# EAGLE design charger v2 (EAGLE 5.07)
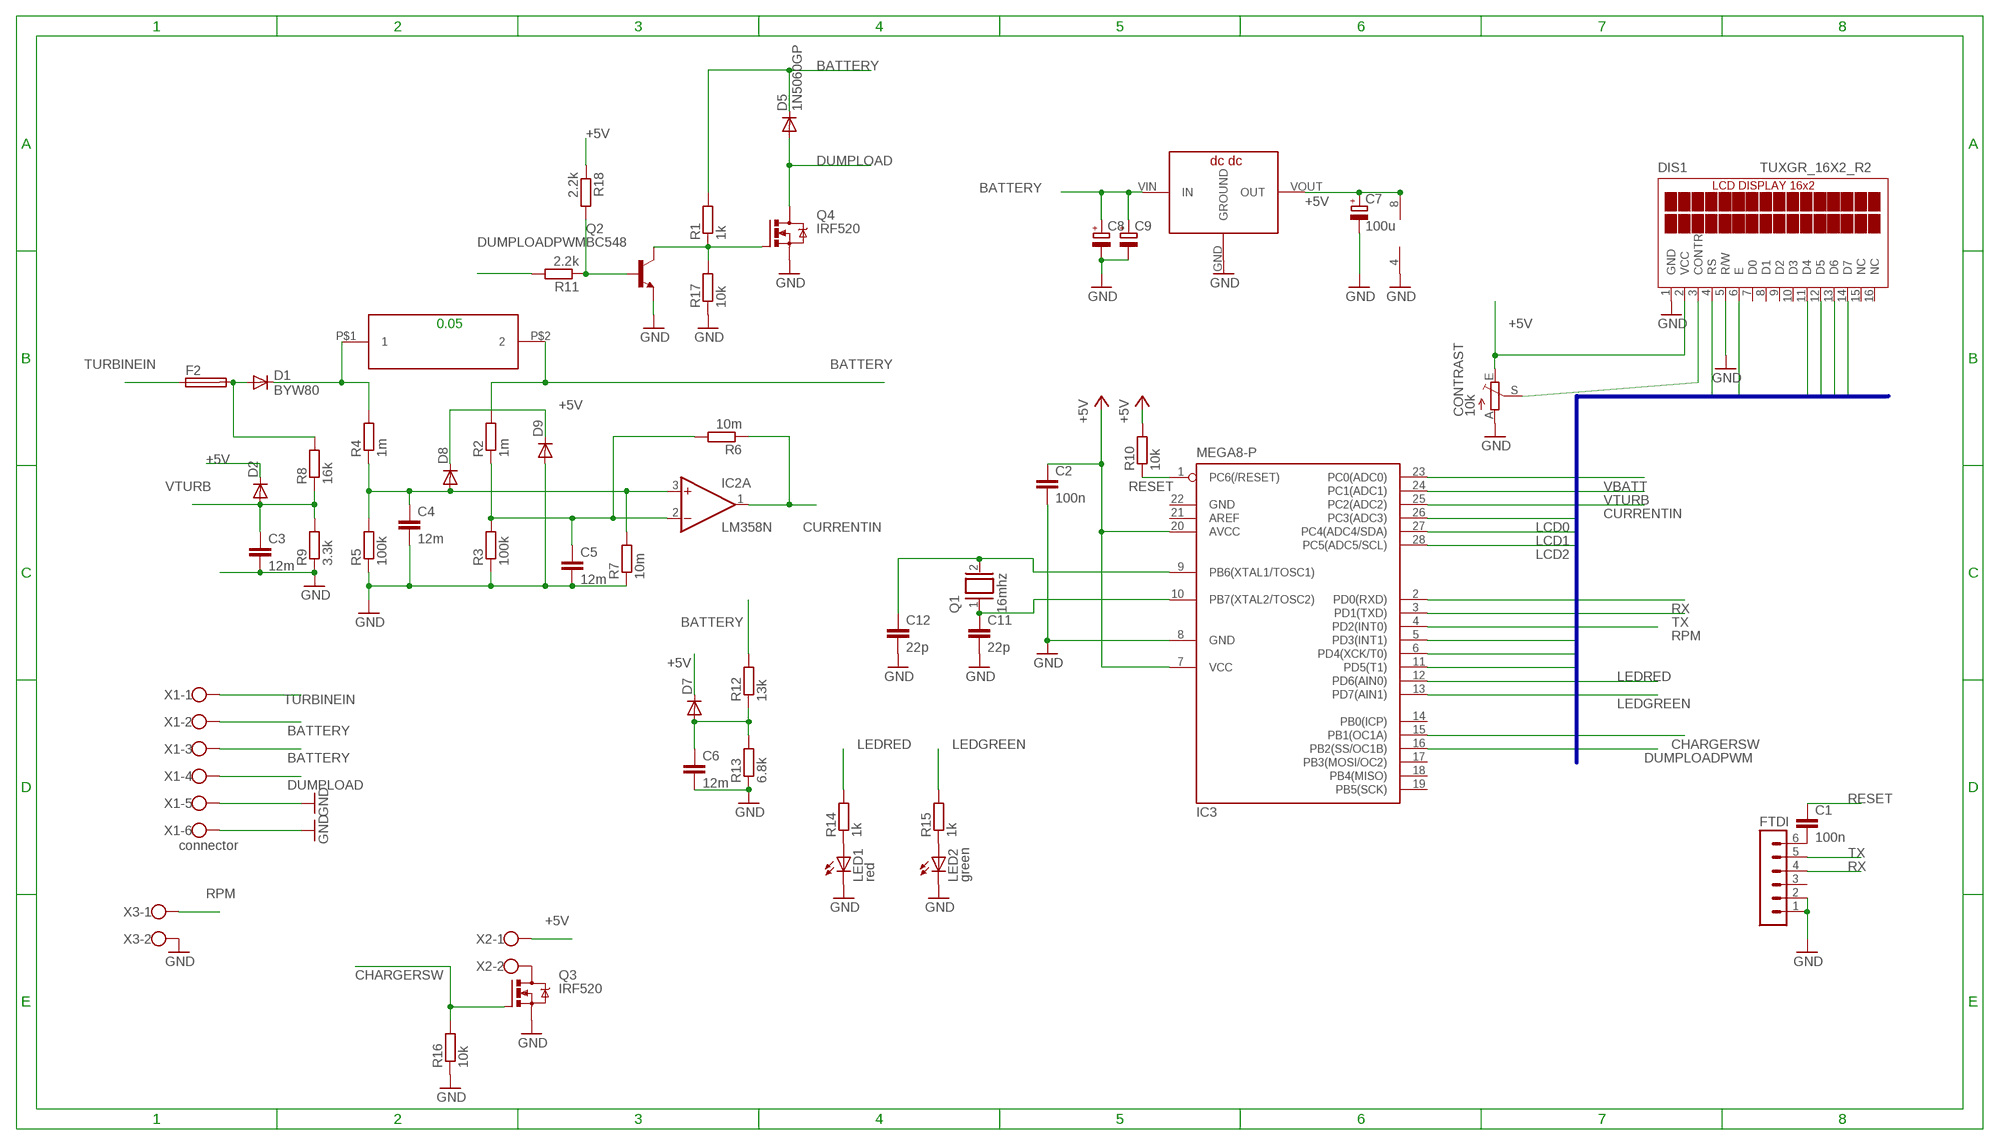
[diagram p0: schematic, sheet 1]

## Parts
C1  100n  C5/2.5  [C5B2.5]
C2  100n  C5/2.5  [C5B2.5]
C3  12m  C5/2.5  [C5B2.5]
C4  12m  C5/2.5  [C5B2.5]
C5  12m  C5/2.5  [C5B2.5]
C6  12m  C5/2.5  [C5B2.5]
C7  100u  CPOL-EUE2,5-6E  [E2,5-6E]
C8  CPOL-EUE3.5-8  [E3,5-8]
C9  CPOL-EUE3.5-8  [E3,5-8]
C11  22p  C-EU050-025X075  [C050-025X075]
C12  22p  C-EU050-025X075  [C050-025X075]
CONTRAST  10k  TRIM_EU-CA9V  [CA9V]
D1  BYW80  [TO220ACS]
D2  1N4148DO35-7  [DO35-7]
D5  1N5060GP  [DO15-12]
D7  1N4148DO35-7  [DO35-7]
D8  1N4148DO35-7  [DO35-7]
D9  1N4148DO35-7  [DO35-7]
DIS1  TUXGR_16X2_R2  [TUXGR_16X2_R2]
F2  SH22,5  [SH22,5]
FTDI  MA06-1  [MA06-1]
IC2  LM358N  [DIL08]
IC3  MEGA8-P  [DIL28-3]
LED1  red  LED5MM  [LED5MM]
LED2  green  LED5MM  [LED5MM]
Q1  16mhz  XTAL/S  [QS]
Q2  BC548  [TO92-EBC]
Q3  IRF520  [TO220BV]
Q4  IRF520  [TO220BV]
R1  1k  R-EU_0204/7  [0204/7]
R2  1m  R-EU_0204/7  [0204/7]
R3  100k  R-EU_0204/7  [0204/7]
R4  1m  R-EU_0204/7  [0204/7]
R5  100k  R-EU_0204/7  [0204/7]
R6  10m  R-EU_0204/7  [0204/7]
R7  10m  R-EU_0204/7  [0204/7]
R8  16k  R-EU_0204/7  [0204/7]
R9  3.3k  R-EU_0204/7  [0204/7]
R10  10k  R-EU_0204/7  [0204/7]
R11  2.2k  R-EU_0204/7  [0204/7]
R12  13k  R-EU_0204/7  [0204/7]
R13  6.8k  R-EU_0204/7  [0204/7]
R14  1k  R-EU_0204/7  [0204/7]
R15  1k  R-EU_0204/7  [0204/7]
R16  10k  R-EU_0204/7  [0204/7]
R17  10k  R-EU_0204/7  [0204/7]
R18  2.2k  R-EU_0204/7  [0204/7]
U$1  R-5MM  [R-5MM]
U$2  TSR1-DCDC  [TSR1-DCDC]
X1  connector  W237-6  [W237-6]
X2  W237-102  [W237-102]
X3  W237-102  [W237-102]

## Nets
+5V: C2.1 C7.+ CONTRAST.E D2.C D7.C D8.C D9.C DIS1.2(VCC) IC2.8(P:V+) IC3.7(VCC) IC3.20(AVCC) R10.2 R18.1 U$2.VOUT(OUT) X2.1
BATTERY [power]: C8.+ C9.+ D5.C R1.2 R2.2 R12.2 U$1.P$2 U$2.VIN(IN) X1.2 X1.3
CHARGERSW: IC3.15(PB1(OC1A)) Q3.G R16.2
CURRENTIN: IC2.1(A:OUT) IC3.25(PC2(ADC2)) R6.1
DUMPLOAD [power]: D5.A Q4.D X1.4
DUMPLOADPWM: IC3.16(PB2(SS/OC1B)) R11.2
GND: C2.2 C3.2 C4.2 C5.2 C6.2 C7.- C8.- C9.- C11.2 C12.2 CONTRAST.A D9.A DIS1.1(GND) DIS1.5(R/W) FTDI.1 FTDI.2 IC2.4(P:V-) IC3.8(GND) LED1.K(C) LED2.K(C) Q2.E Q3.S Q4.S R3.1 R5.1 R7.1 R9.1 R13.1 R16.1 R17.1 U$2.GND(GROUND) X1.5 X1.6 X3.2
LCD0: DIS1.4(RS) IC3.26(PC3(ADC3))
LCD1: DIS1.6(E) IC3.27(PC4(ADC4/SDA))
LCD2: DIS1.11(D4) IC3.28(PC5(ADC5/SCL))
LCD3: DIS1.12(D5) IC3.11(PD5(T1))
LCD4: DIS1.13(D6) IC3.6(PD4(XCK/T0))
LCD5: DIS1.14(D7) IC3.5(PD3(INT1))
LEDGREEN: IC3.13(PD7(AIN1)) R15.2
LEDRED: IC3.12(PD6(AIN0)) R14.2
N$1 [power]: D1.C R4.2 U$1.P$1
N$2: Q2.C Q4.G R1.1 R17.2
N$3: D1.A F2.2 R8.2
N$5: C1.2 FTDI.6
N$6: Q3.D X2.2
N$8: Q2.B R11.1 R18.2
N$9: CONTRAST.S DIS1.3(CONTR)
N$10: C11.1 IC3.10(PB7(XTAL2/TOSC2)) Q1.1
N$11: C12.1 IC3.9(PB6(XTAL1/TOSC1)) Q1.2
N$13: LED1.A R14.1
N$15: LED2.A R15.1
N$16 [power]: C4.1 D8.A IC2.3(A:+IN) R4.1 R5.2 R7.2
N$17 [power]: C5.1 IC2.2(A:-IN) R2.1 R3.2 R6.2
RESET: C1.1 IC3.1(PC6(/RESET)) R10.1
RPM: IC3.4(PD2(INT0)) X3.1
RX: FTDI.4 IC3.2(PD0(RXD))
TURBINEIN [power]: F2.1 X1.1
TX: FTDI.5 IC3.3(PD1(TXD))
VBATT: C6.1 D7.A IC3.23(PC0(ADC0)) R12.1 R13.2
VTURB: C3.1 D2.A IC3.24(PC1(ADC1)) R8.1 R9.2
Unconnected: DIS1.7(D0) DIS1.8(D1) DIS1.9(D2) DIS1.10(D3) DIS1.15(NC) DIS1.16(NC) FTDI.3 IC2.5(B:+IN) IC2.6(B:-IN) IC2.7(B:OUT) IC3.14(PB0(ICP)) IC3.17(PB3(MOSI/OC2)) IC3.18(PB4(MISO)) IC3.19(PB5(SCK)) IC3.21(AREF)

## Buses
LCD[0..5]

## Notes on the sheet
- 0.05

## Power pins joined to a net without a drawn wire
GND: IC3.22(GND)

## Library data of the parts
C1-C6 = capacitor-wima:C: CAPACITOR naming: grid - package width
C7 = rcl:CPOL-EU: POLARIZED CAPACITOR, European symbol
C8 C9 = resistor:CPOL-EU: POLARIZED CAPACITOR, European symbol
C11 C12 = rcl:C-EU: CAPACITOR, European symbol
CONTRAST = pot:TRIM_EU-: POTENTIOMETER
D1 = diode:BYW80: DIODE high-efficiency fast recovery rectifier (ST)
D2 D7-D9 = diode:1N4148: DIODE high speed (Philips)
D5 = diode:1N5060GP: DIODE controlled avalanche rectifier
DIS1 = display-lcd:TUXGR_16X2_R2: Tuxgraphics LCD display 16x2 characters reflective, without background light Source: tuxgr_12x2_r2.pdf
F2 = fuse:SH22,5: FUSE HOLDER grid 22,5 mm, OGN0031 8201, Schurter (Buerklin)
FTDI = con-lstb:MA06-1: PIN HEADER
IC2 = linear:LM358: OP AMP also LM158; LM258; LM2904 Source: http://cache.national.com/ds/LM/LM158.pdf
IC3 = atmel:MEGA8-P: MICROCONTROLLER 8 Kbytes FLASH, 1 kbytes SRAM, 512 bytes EEPROM, USART, 4-channel 10 bit ADC, 2-channel 8 bit ADC Pin compatible with Atmega48, ATMega88, ATMega168 Source: avr.lbr
LED1 LED2 = led:LED: LED OSRAM: - CHIPLED LG R971, LG N971, LY N971, LG Q971, LY Q971, LO R971, LY R971 LH N974, LH R974 LS Q976, LO Q976, LY Q976 LO Q996 - Hyper CHIPLED LW Q18S LB Q993, LB Q99A, LB R99A - SideLED LS A670, LO A670, LY A670, LG A670, LP A670 LB A673, LV A673, LT A673, LW A673 LH A674 LY A675 LS A676, LA A676, LO A676, LY A676, LW A676 LS A679, LY A679, LG A679 - Hyper Micro SIDELED® LS Y876, LA Y876, LO Y876, LY Y876 LT Y87S - SmartLED LW L88C, LW L88S LB L89C, LB L89S, LG L890 LS L89K, LO L89K, LY L89K LS L896, LA L896, LO L896, LY L896 - TOPLED LS T670, LO T670, LY T670, LG T670, LP T670 LSG T670, LSP T670, LSY T670, LOP T670, LYG T670 LG T671, LOG T671, LSG T671 LB T673, LV T673, LT T673, LW T673 LH T674 LS T676, LA T676, LO T676, LY T676, LB T676, LH T676, LSB T676, LW T676 LB T67C, LV T67C, LT T67C, LS T67K, LO T67K, LY T67K, LW E67C LS E67B, LA E67B, LO E67B, LY E67B, LB E67C, LV E67C, LT E67C LW T67C LS T679, LY T679, LG T679 LS T770, LO T770, LY T770, LG T770, LP T770 LB T773, LV T773, LT T773, LW T773 LH T774 LS E675, LA E675, LY E675, LS T675 LS T776, LA T776, LO T776, LY T776, LB T776 LHGB T686 LT T68C, LB T68C - Hyper Mini TOPLED® LB M676 - Mini TOPLED Santana® LG M470 LS M47K, LO M47K, LY M47K Source: http://www.osram.convergy.de LUXEON: - LUMILED® LXK2-PW12-R00, LXK2-PW12-S00, LXK2-PW14-U00, LXK2-PW14-V00 LXK2-PM12-R00, LXK2-PM12-S00, LXK2-PM14-U00 LXK2-PE12-Q00, LXK2-PE12-R00, LXK2-PE12-S00, LXK2-PE14-T00, LXK2-PE14-U00 LXK2-PB12-K00, LXK2-PB12-L00, LXK2-PB12-M00, LXK2-PB14-N00, LXK2-PB14-P00, LXK2-PB14-Q00 LXK2-PR12-L00, LXK2-PR12-M00, LXK2-PR14-Q00, LXK2-PR14-R00 LXK2-PD12-Q00, LXK2-PD12-R00, LXK2-PD12-S00 LXK2-PH12-R00, LXK2-PH12-S00 LXK2-PL12-P00, LXK2-PL12-Q00, LXK2-PL12-R00 Source: www.luxeon.com KINGBRIGHT: KA-3528ASYC Source: www.kingbright.com
Q1 = special:XTAL/S: CRYSTAL
Q2 = transistor-npn:BC548*: NPN Transistor
Q3 Q4 = transistor-power:IRF520: HEXFET Power MOSFET
R1-R18 = rcl:R-EU_: RESISTOR, European symbol
U$1 = matt:R-5MM
U$2 = matt:TSR1-DCDC: traco dc/dc converter tsr-1 series
X1 = con-wago-500:W237-6: WAGO SCREW CLAMP
X2 X3 = con-wago-500:W237-102: WAGO SCREW CLAMP

## Net classes
1 power: width 2 mm

## Board
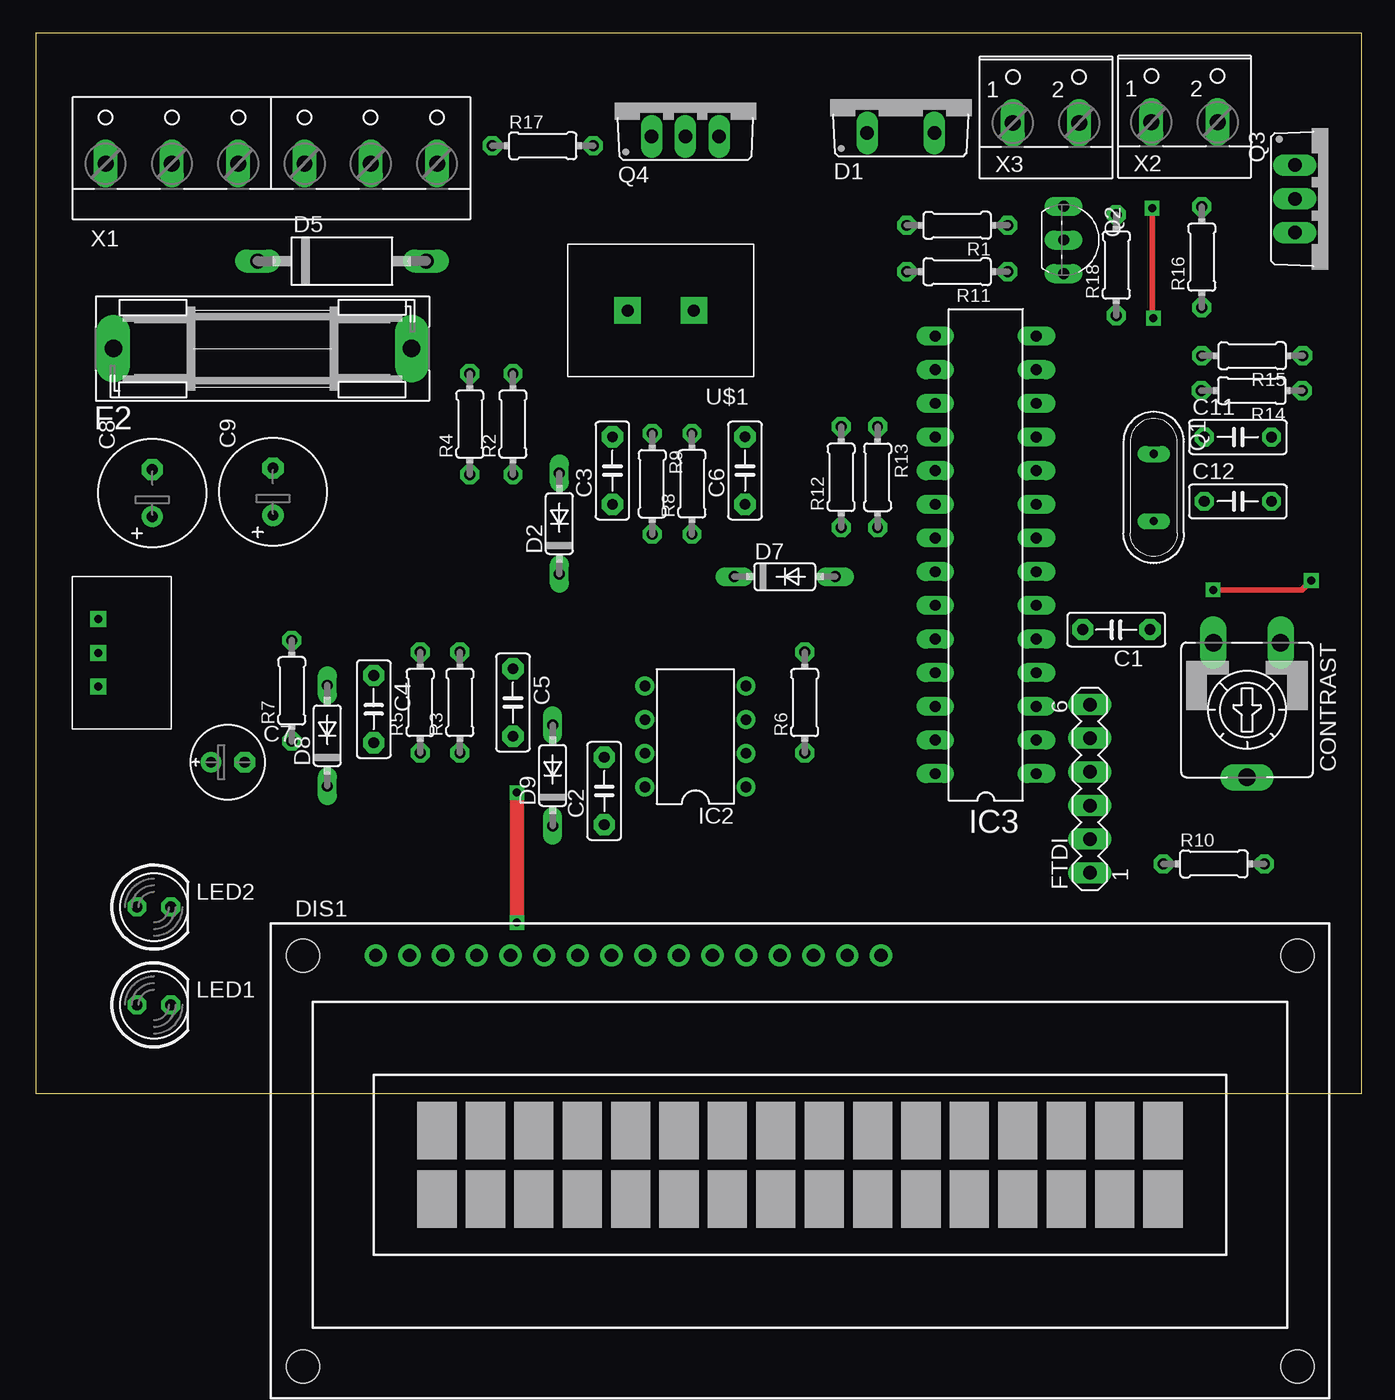
[diagram p1: board, top side]
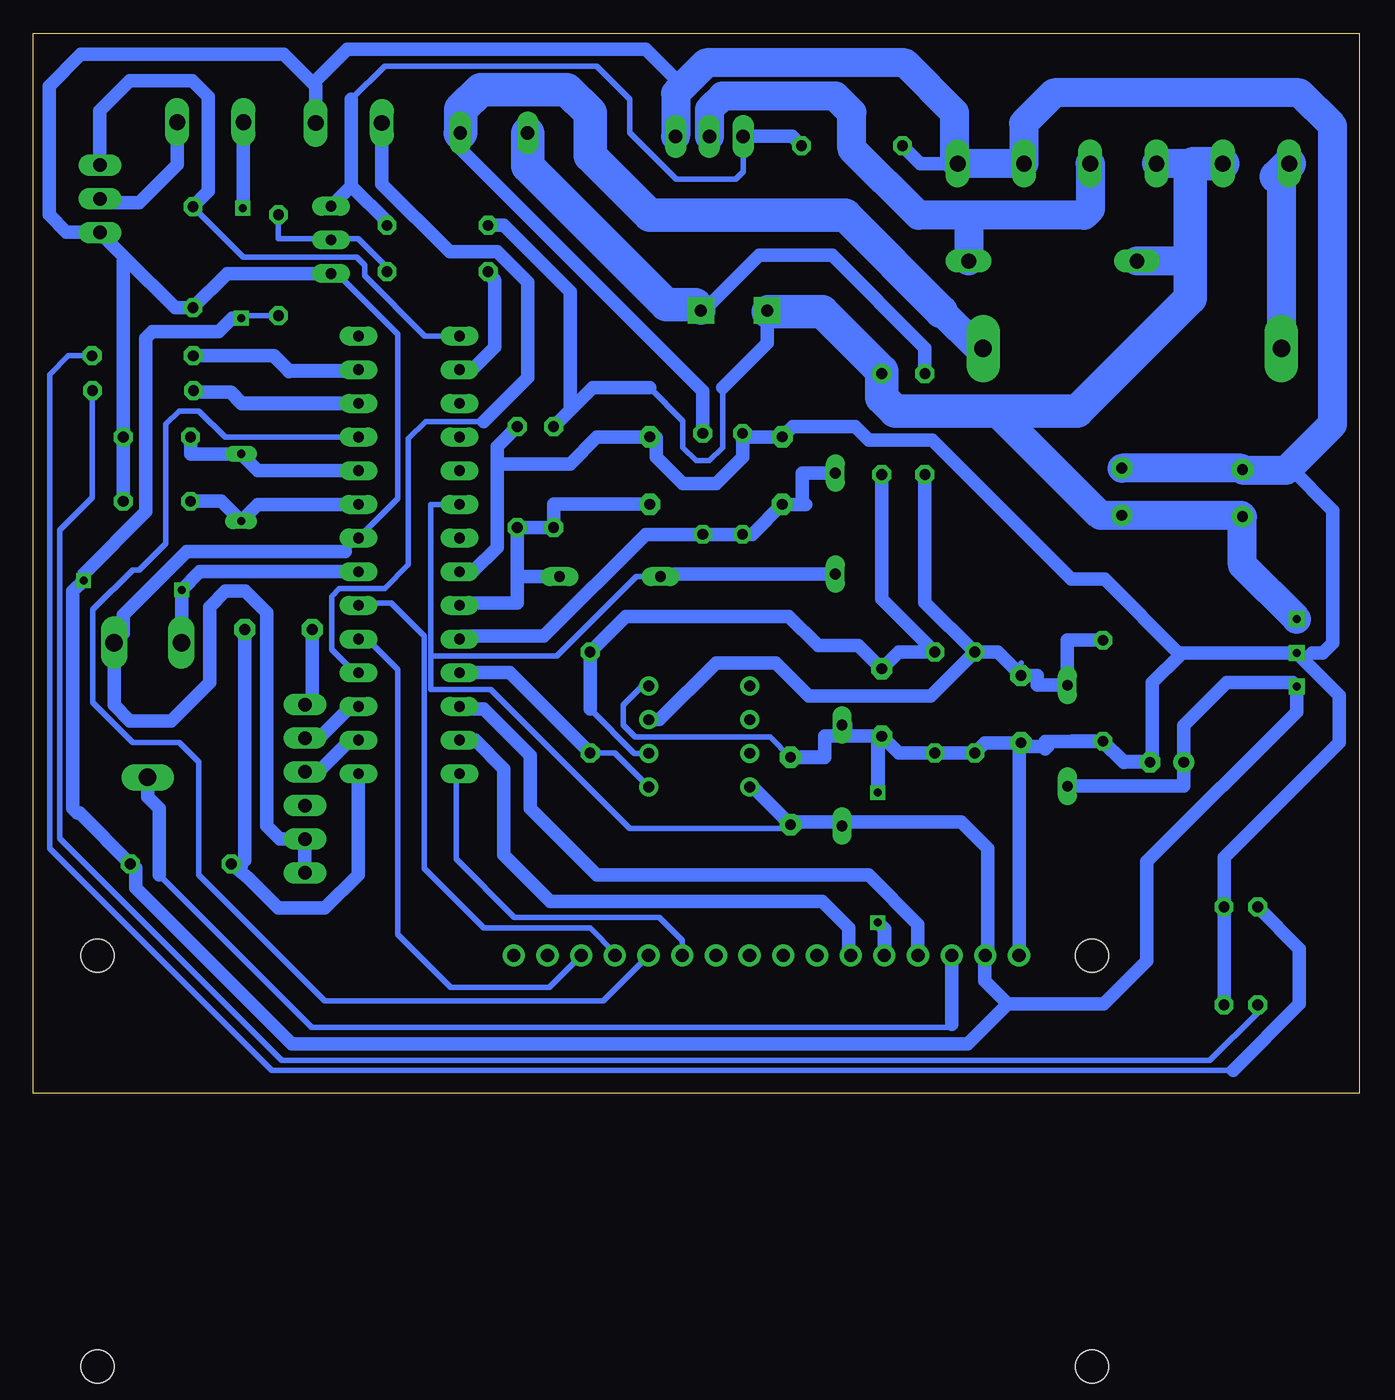
[diagram p2: board, bottom side, seen from below]

Size 100 x 80 mm. Coordinates in mm from the lower left corner, seen from the top.
Outline: 0,0 100,0 100,80 0,80 0,0
Copper layers (1*16): Top 0.035mm / dielectric 1.5mm / Bottom 0.035mm
Design rules "SparkFun": minimum track width 8mil, minimum drill 20mil, track to track 8mil, track to pad 8mil, pad to pad 8mil, via to via 8mil, smd to smd 8mil, copper to edge 10mil, drill to drill 8mil, minimum pad ring 12mil, minimum via ring 10mil, stop-mask expansion 4mil, vias tented up to drill 25mil, thermal gap 10mil

### Footprints (pad centres in the part's own frame; a part is rotated, then mirrored left to right if it is on the bottom)
C5B2.5 = drill 0.813 pad 1.6 octagon: 1 -2.54,0; 2 2.54,0
E2,5-6E = drill 0.813 pad 1.575 round: + -1.27,0 | drill 0.813 pad 1.575 octagon: - 1.27,0
E3,5-8 = drill 0.813 pad 1.6 round: + -1.778,0 | drill 0.813 pad 1.6 octagon: - 1.778,0
C050-025X075 = drill 0.813 octagon: 1 -2.54,0; 2 2.54,0
CA9V = drill 1.321 long: A -2.54,-5.08; E 2.54,-5.08; S 0,5.08
TO220ACS = drill 1.016 long: A 2.54,-2.54; C -2.54,-2.54
DO35-7 = drill 0.813 long: A 3.81,0; C -3.81,0
DO15-12 = drill 1.118 long: A 6.35,0; C -6.35,0
TUXGR_16X2_R2 = drill 1 pad 1.676 round: 1 -32,15.5; 2 -29.46,15.5; 3 -26.92,15.5; 4 -24.38,15.5; 5 -21.84,15.5; 6 -19.3,15.5; 7 -16.76,15.5; 8 -14.22,15.5; 9 -11.68,15.5; 10 -9.14,15.5; 11 -6.6,15.5; 12 -4.06,15.5; 13 -1.52,15.5; 14 1.02,15.5; 15 3.56,15.5; 16 6.1,15.5 | hole 2.5: -37.5,-15.5; 37.5,-15.5; -37.5,15.5; 37.5,15.5
SH22,5 = drill 1.321 pad 2.54 long: 1 -11.252,0; 2 11.252,0
MA06-1 = drill 1.016 long: 1 -6.35,0; 2 -3.81,0; 3 -1.27,0; 4 1.27,0; 5 3.81,0; 6 6.35,0
DIL08 = drill 0.813 pad 1.27 round: 1 -3.81,-3.81; 2 -1.27,-3.81; 3 1.27,-3.81; 4 3.81,-3.81; 5 3.81,3.81; 6 1.27,3.81; 7 -1.27,3.81; 8 -3.81,3.81
DIL28-3 = drill 0.813 long: 1 -16.51,-3.81; 2 -13.97,-3.81; 3 -11.43,-3.81; 4 -8.89,-3.81; 5 -6.35,-3.81; 6 -3.81,-3.81; 7 -1.27,-3.81; 8 1.27,-3.81; 9 3.81,-3.81; 10 6.35,-3.81; 11 8.89,-3.81; 12 11.43,-3.81; 13 13.97,-3.81; 14 16.51,-3.81; 15 16.51,3.81; 16 13.97,3.81; 17 11.43,3.81; 18 8.89,3.81; 19 6.35,3.81; 20 3.81,3.81; 21 1.27,3.81; 22 -1.27,3.81; 23 -3.81,3.81; 24 -6.35,3.81; 25 -8.89,3.81; 26 -11.43,3.81; 27 -13.97,3.81; 28 -16.51,3.81
LED5MM = drill 0.813 octagon: A -1.27,0; K 1.27,0
QS = drill 0.61 long: 1 -2.54,0; 2 2.54,0
TO92-EBC = drill 0.813 long: B 0,-1.27; C -2.54,-1.27; E 2.54,-1.27
TO220BV = drill 1.016 long: D 0,-2.54; G -2.54,-2.54; S 2.54,-2.54
0204/7 = drill 0.813 octagon: 1 -3.81,0; 2 3.81,0
R-5MM = drill 0.9 pad 2 square: P$1 -2.5,0; P$2 2.5,0
TSR1-DCDC = drill 0.6 square: GND -0.254,2.032; VIN 2.286,2.032; VOUT -2.794,2.032
W237-6 = drill 1.194 long: 1 -12.5,-1.27; 2 -7.5,-1.27; 3 -2.5,-1.27; 4 2.5,-1.27; 5 7.5,-1.27; 6 12.5,-1.27
W237-102 = drill 1.194 long: 1 -2.5,-1.27; 2 2.5,-1.27

### Placement (x,y rotation side)
C1  81.5,35 180 top
C2  42.89,22.83 90 top
C3  43.5,47 90 top
C4  25.5,29 270 top
C5  36,29.5 270 top
C6  53.5,47 90 top
C7  14.5,25 0 top
C8  8.8,45.3 90 top
C9  17.9,45.4 90 top
C11  90.67,49.53 0 top
C12  90.67,44.68 0 top
CONTRAST  91.36,28.94 180 top
D1  65.25,75 0 top
D2  39.5,43 90 top
D5  23.1,62.8 0 top
D7  56.5,39 0 top
D8  22,27 90 top
D9  39,24 90 top
DIS1  57.65,-5.08 0 top
F2  17.11,56.2 0 top
FTDI  79.5,23 90 top
IC2  49.76,26.94 90 top
IC3  71.66,40.64 90 top
LED1  8.92,6.69 0 top
LED2  8.92,14.07 0 top
Q1  84.32,45.72 270 top
Q2  78.8,64.4 270 top
Q3  97.5,67.5 270 top
Q4  49,74.75 0 top
R1  69.5,65.5 180 top
R2  36,50.5 90 top
R3  32,29.5 90 top
R4  32.75,50.5 90 top
R5  29,29.5 90 top
R6  58,29.5 90 top
R7  19.32,30.39 90 top
R8  49.5,46 90 top
R9  46.5,46 270 top
R10  88.86,17.33 0 top
R11  69.5,62 180 top
R12  60.75,46.5 90 top
R13  63.5,46.5 270 top
R14  91.72,53.03 180 top
R15  91.75,55.66 180 top
R16  87.95,63.1 90 top
R17  38.25,71.5 0 top
R18  81.5,62.5 90 top
U$1  47.15,59.07 180 top
U$2  6.75,33.5 90 top
X1  17.78,71.43 0 top
X2  86.64,74.56 0 top
X3  76.2,74.5 0 top

### Tracks (layer width: path | path; a pad name or v marks a point on that pad's centre or on a via)
+5V  (via drill 0.6)
  Top 0.406: v84.2,66.8 84.2,58.6 v84.3,58.5 | v88.8,38 95.5,38 v96.2,38.7
  Bottom 0.406: 28,11 28.5,10.5 28.27,10.5 DIS1.2 28.25,10.36 | 42.68,20.5 C2.1 43.18,20 55,20 65.5,30.5 70,30.5 70,33 | 45.73,23.13 IC2.8 | 88.8,33.9 88.8,34 CONTRAST.E 88.8,34.04 | v84.2,66.8 84.14,66.86 | v96.2,38.7 96.2,39.2 | IC3.20 70,44.45 70,33 | D7.C 54.5,39 60.5,33 70,33 | R18.1 84.3,58.69 v84.3,58.5
  Bottom 1.016: 28,11 28,18.5 30,20.5 39,20.5 | 39,20.5 42.68,20.5 | C2.1 45.73,23.13 | 26.5,6.75 19.25,6.75 16,10 16,17.5 4.72,28.78 U$2.VOUT 5.01,31 10,31 13.23,27.77 C7.+ 13.23,23.19 D8.C | 26.5,6.75 28.25,8.5 28.25,10.36 | 26.5,6.75 29.5,3.75 80.5,3.75 92.25,15.5 92.25,17.02 92.56,17.33 R10.2 96.5,21.16 96.66,21.16 97,21.5 97,37.9 v96.2,38.7 | IC3.7 87.43,39.37 v88.8,38 88.8,34.04 | 84.14,66.86 X2.1 | v84.3,58.5 85,58.5 86,57.5 91,57.5 91.5,57 91.5,43.9 96.2,39.2 | 39,20.5 D9.C | D2.C 52.69,39.19 D7.C
BATTERY
  Bottom 0.406: 48,53.25 48,48.75 49,47.75 50,47.75 51,48.75 51,50.75 53.5,53.25
  Bottom 1.016: U$1.P$2 44.65,56.6 48,53.25 | U$2.VIN 5.54,35.79 | R1.2 64.5,65.5 59.5,60.5 59.5,51.56 | 53.5,53.25 57.81,53.25 59.5,51.56 | R12.2 59.53,51.53 59.5,51.56
  Bottom 2.184: R2.2 36,54.5 | 44.58,59 U$1.P$2 | 12.75,69.91 12.5,70.16 | 12.25,70.16 X1.3 | D5.C 12.95,62.8 12.75,63 | U$2.VIN 8.8,39.87 C8.+ 8.9,43.62 C9.+ 19.52,43.62 27.4,51.5
  Bottom 2.54: 12.5,70.16 12.25,70.16 X1.2 | 36,54.5 40.5,59 44.58,59 | R2.2 36,52.5 35,51.5 27.4,51.5 21.25,51.5 12.75,60 12.75,63 12.75,69.91
CHARGERSW
  Bottom 0.406: Q3.G 95.31,70.39 95.1,70.6 | IC3.15 70.45,57.15 75,61.7 75,62.5 75.6,63.1 84.14,63.1 R16.2
  Bottom 1.016: Q3.G 94.96,74.14 92.7,76.4 88,76.4 86.8,75.2 86.8,68.06 R16.2
CURRENTIN
  Bottom 0.406: R6.1 56.13,25.69 IC2.1
  Bottom 1.016: IC3.25 64.06,31.75 R6.1
DUMPLOAD
  Bottom 2.184: Q4.D 49,74.25 48,75.25 39.5,75.25 38.25,74 38.25,71.25 33.25,66.25 29.2,66.25 | 29.2,66.25 20.75,66.25 20.25,66.75 20.25,70.13 X1.4 | D5.A 29.45,66 29.2,66.25
DUMPLOADPWM
  Bottom 0.406: IC3.16 66.89,54.61
  Bottom 1.016: 66.89,54.61 65.2,56.3 65.2,61.31 R11.2
GND  (via drill 0.6)
  Top 1.05: v36.3,22.7 v36.3,12.9
  Bottom 0.406: C6.2 53.04,49.54 53,49.5 | 23.69,26 23.5,26.19 | IC2.4 54.05,30.75 55.5,29.3 55.5,27.8 54.6,26.9 44.42,26.9 C2.2 | 93.21,34.71 CONTRAST.A | 78.7,76.4 78.7,76 | 76.48,40.9 IC3.8 72.5,44.88 72.5,57.3 77.06,61.86 Q2.E | 13.35,33.25 13.5,33.1 | 15.6,25.17 C7.- | U$2.GND 3.55,33.25 | 25.3,70.18 X1.5 | IC3.22 66.83,39.37 | C4.2 25.65,26.31 | 57.46,49.54 57.49,49.51
  Bottom 1.016: C12.2 C11.2 93.21,62.79 93,63 | FTDI.1 FTDI.2 81.39,19.19 82.4,20.2 82.4,36.3 84,37.9 85.5,37.9 86.7,36.7 86.7,31 89.6,28.1 92.7,28.1 93.9,29.3 CONTRAST.A | Q3.S 94.53,64.96 | LED1.K LED2.K 10.19,17.81 1.5,26.5 1.5,30.03 U$2.GND 13.35,33.25 | 23.5,26.19 25.23,26.19 C4.2 28.23,26.46 R5.1 R3.1 34.73,25.69 C5.2 38.73,26.96 | C6.2 56.66,49.54 57.46,49.54 | 53,49.5 53,48 51,46 48.5,46 46.5,48 R9.1 46.23,49.54 C3.2 42.73,50.31 38.01,50.31 37,49.3 32.2,49.3 21.7,38.8 19.2,38.8 13.5,33.1 15.6,31 15.6,25.17 | X1.6 33.1,70.16 R17.1 | 93,63 89.29,59.29 R16.1 85.38,61.86 Q2.E | Q3.S 93,63 | X3.2 78.7,76 81.1,78.4 96.4,78.4 98.8,76 98.8,66.3 97.5,65 95,65 Q3.S | 78.7,76.4 76.3,78.8 53.8,78.8 51,76 | 93.21,34.71 93.21,36.09 88.4,40.9 76.48,40.9 | 66.83,39.37 65,41.2 65,47.5 | 65,47.5 65,48.81 R13.1 63.41,50.4 | 25.65,26.31 DIS1.1 | 57.49,49.51 59.5,47.5 65,47.5 | 3.55,33.25 2.75,33.25 2,34 2,44 5.25,47.25 | 21.61,26.58 23.69,26.58 23.69,26 | D9.A 38.73,27.81 38.73,26.96 | 38.73,26.96 40.32,26.96 40.32,25.37
  Bottom 1.05: 40.32,25.37 C2.2 | C7.- 17.74,25 R7.1 21.61,26.58 | DIS1.5 35.81,12.41 v36.3,12.9 | v36.3,22.7 36.3,26.66 C5.2
  Bottom 2.184: Q4.S 51.54,75.46 51,76 49.25,77.75 34.25,77.75 30.5,74 30.5,70.38 X1.6 X1.5 | C9.- 8.9,47.18 C8.- 8.72,47 5.5,47 5.25,47.25 2,50.5 2,73 4.5,75.5 23,75.5 25.3,73.2 25.3,70.18
LCD0
  Bottom 1.016: DIS1.4 33.27,12.77 37,16.5 57.5,16.5 62.5,21.5 62.5,25.5 66,29 67.64,29 IC3.26
LCD1
  Bottom 1.016: IC3.27 66.67,26.67 64.5,24.5 64.5,18 61,14.5 40.5,14.5 38.5,12.5 38.5,10.57 DIS1.6
LCD2
  Bottom 0.406: DIS1.11 51.05,11.55 52.8,13.3 63.7,13.3 68.1,17.7 68.1,23.88 IC3.28
LCD3
  Bottom 0.406: IC3.11 85.53,49.53 87.5,51.5 89,51.5 90,50.5 90,41.5 92,39.5 92.5,39.5 95.5,36.5 95.5,29.5 92.5,26.5 89,26.5 87.5,25 87.5,16.5 78,7 57.01,7 DIS1.12
LCD4
  Bottom 0.406: DIS1.13 56.13,10.63 58,12.5 66,12.5 70.5,17 70.5,34.5 73,37 75.3,37 IC3.6
LCD5
  Bottom 0.406: IC3.5 74.79,34.29 72.5,32 72.5,12 68.5,8 61.09,8 DIS1.14
LEDGREEN
  Bottom 0.406: IC3.13 75.58,54.5
  Bottom 1.016: 81.86,55.66 R15.2
  Bottom 1.05: 81.86,55.66 80.7,54.5 75.58,54.5
LEDRED
  Bottom 1.016: 85.1,52.9 87.78,52.9 R14.2
  Bottom 1.05: IC3.12 84.27,52.07 85.1,52.9
N$1
  Bottom 1.016: U$1.P$1 49.43,59.07 45.25,63.25 39.75,63.25 32.75,56.25 R4.2
  Bottom 2.184: U$1.P$1 50.08,59.5
  Bottom 2.54: D1.C 62.71,69.96 52.25,59.5 50.08,59.5
N$2
  Bottom 0.406: Q4.G 46.46,69.54 47,69 51.5,69 55,72.5 55,75 57.5,77.5 73.5,77.5 76,75 | R1.1 73.31,65.78
  Bottom 1.016: Q4.G 42.77,72.21 R17.2 | 76,75 76,68.47 | 76,68.47 Q2.C | 73.31,65.78 76,68.47
N$3
  Bottom 1.016: D1.A 68,72.25 68,71.5 49.5,53 R8.2
  Bottom 2.184: F2.2 28.7,56.2 31.5,59
  Bottom 2.54: 31.5,59 38.75,66.25 53.5,66.25 58,70.75 58,74 59.75,75.75 66.25,75.75 67.75,74.25 67.75,72.5 D1.A
N$5
  Bottom 0.406: FTDI.6 78.96,29.89
  Bottom 1.016: 78.96,29.89 C1.2
N$6
  Bottom 0.406: 94.66,67.2 Q3.D
  Bottom 1.016: X2.2 89.14,70.06 92,67.2 94.66,67.2
N$8
  Bottom 0.406: R11.1 73.31,62.31 75.5,64.5 77.43,64.5 Q2.B 77.53,64.5 81.5,64.5 R18.2
N$9
  Bottom 0.406: 30.73,5.23 31,5 79,5 90.5,16.5
  Bottom 1.016: 30.73,5.23 DIS1.3 | CONTRAST.S 91.36,22.36 90.5,21.5 90.5,16.5
N$10
  Bottom 1.016: IC3.10 83.05,46.99 Q1.1 88.13,48.26 C11.1
N$11
  Bottom 1.016: IC3.9 83.05,44.45 Q1.2 85.82,44.68 C12.1
N$13
  Bottom 0.406: LED1.A 7.65,6.1 11.25,2.5 81.25,2.5 98,19.25 98,42.5 95.53,44.98 R14.1
N$15
  Bottom 0.406: 9.5,1.75 82,1.75 98.75,18.5 98.75,54.25 97.34,55.66 R15.1
  Bottom 1.016: 9.5,1.75 4.5,6.75 4.5,10.92 LED2.A
N$16
  Bottom 0.406: C4.1 25.98,32.02 25.5,32.5
  Bottom 1.016: R5.2 27.27,33.31 25.98,32.02 | IC2.3 52.79,28.21 48.5,32.5 44,32.5 41.5,30 32.31,30 R5.2 | C4.1 24.27,31.54 24.27,30.81 D8.A 22,34.2 R7.2 19.5,34.38 | R4.1 32.75,37.06 R5.2
N$17
  Bottom 0.406: IC2.2 54.67,25.67 58,29
  Bottom 1.016: R6.2 57.5,33.81 | R6.2 58,29 | R2.1 36,37.31 R3.2 34.73,33.31 C5.1 37.77,33.81 40.81,33.81 43,36 55.31,36 R6.2
RESET
  Bottom 0.406: 84,17.11 R10.1 84.04,17.59 | 75.5,24.1 IC3.1
  Bottom 1.016: R10.1 83.78,16.28 81.5,14 78,14 75.5,16.5 75.5,24.1 | 84.04,17.59 C1.1
RPM
  Bottom 0.406: 66,50.7 70.4,50.7 71.7,49.4 71.7,39.9 73.5,38.1 76.9,38.1 77.5,37.5 77.5,33.5 75.75,31.75 IC3.4
  Bottom 1.016: X3.1 73.7,68.6 68.6,63.5 65,63.5 62.7,61.2 62.7,54 66,50.7
RX
  Bottom 1.016: IC3.2 76.08,26.67 78.5,24.25 79.48,24.25 FTDI.4
TURBINEIN
  Bottom 2.184: 6.26,69.18 5.86,69.18 F2.1
  Bottom 2.54: X1.1 6.26,69.18
TX
  Bottom 1.016: IC3.3 76.04,29.21 78.5,26.75 79.44,26.75 FTDI.5
VBATT
  Bottom 1.016: R12.1 R13.2 63.5,39 | R12.1 60.94,42.75 | 63.5,39 63.5,37 67.68,37 IC3.23 | C6.1 60.75,44.46 R12.1 | D7.A 63.5,39
VTURB
  Bottom 0.406: 45.77,42.19 R9.2 | 67.64,34.5 IC3.24 | 43.5,44.42 C3.1
  Bottom 1.016: R9.2 R8.1 53.81,42.19 61.5,34.5 67.64,34.5 | C3.1 45.77,42.19 | 42,44.42 41.73,44.42 | 42,44.42 43.5,44.42 | D2.A 42,46.81 42,44.42